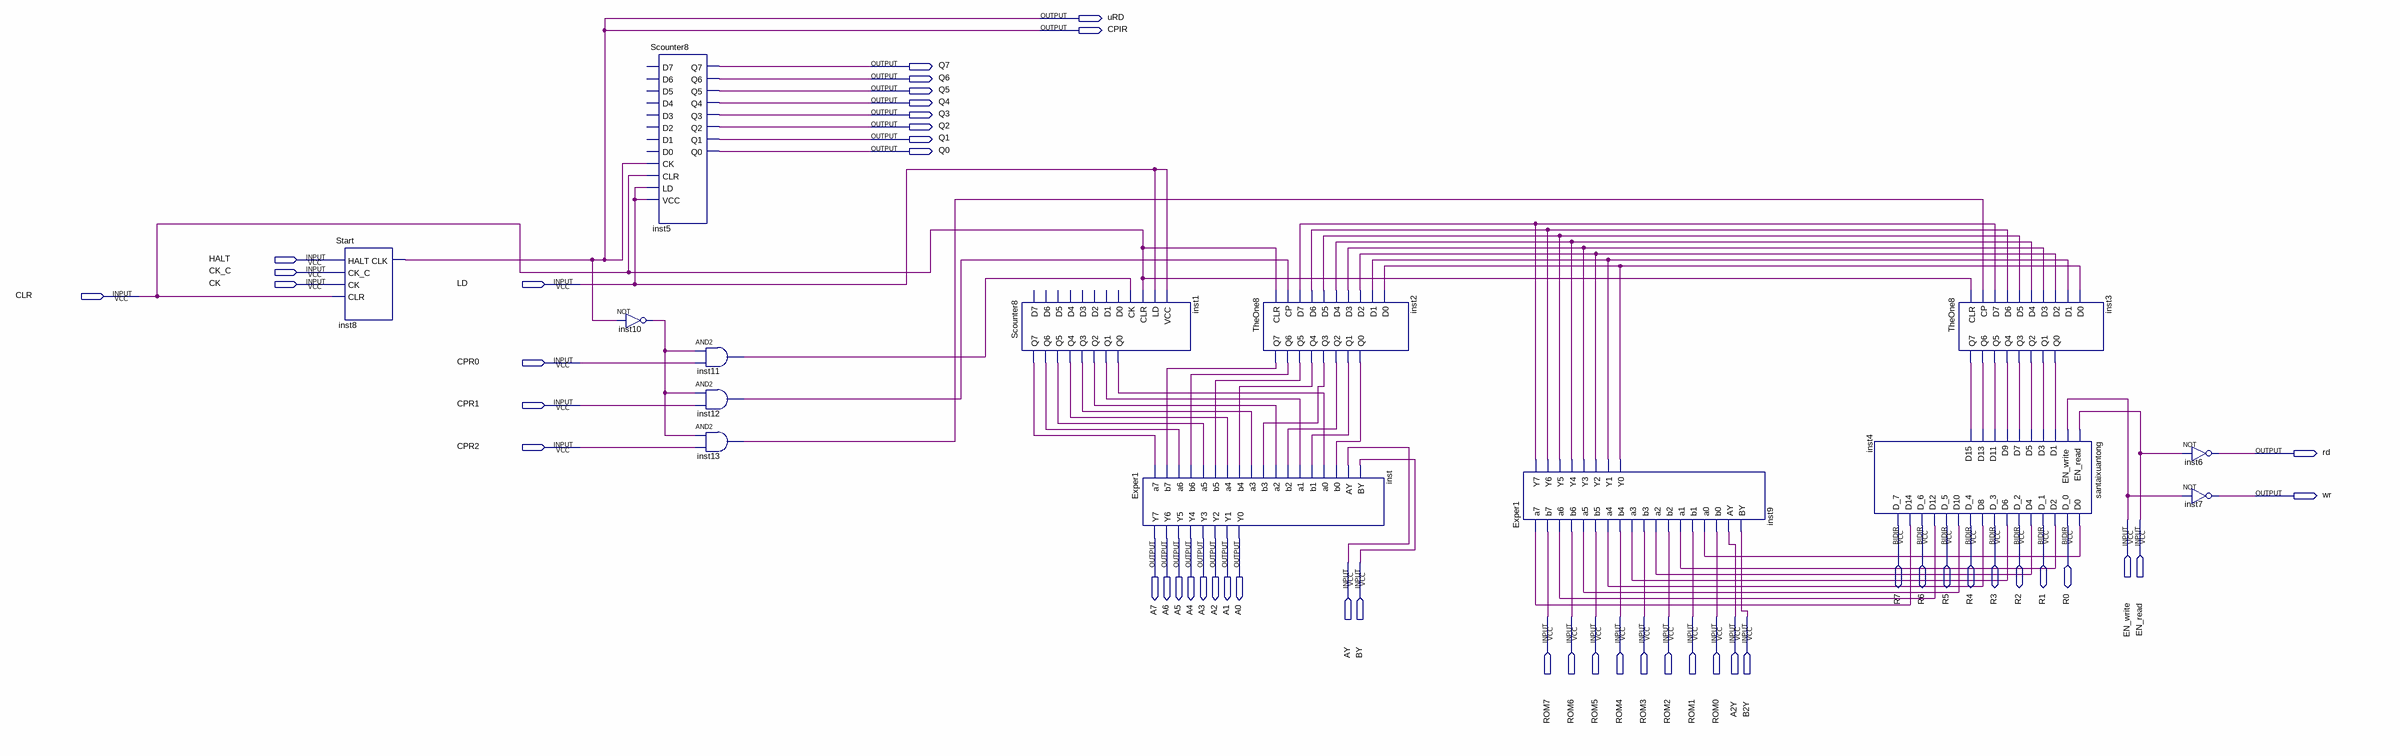
[diagram p0: schematic sheet]
// Quartus schematic Fangcun.bdf as structural Verilog: 14 symbols, 50 pins
module Fangcun (
  input  HALT,
  input  CK_C,
  input  CK,
  input  LD,
  input  CLR,
  input  CPR0,
  input  CPR1,
  input  CPR2,
  input  EN_write,
  input  EN_read,
  input  AY,
  input  BY,
  input  ROM7,
  input  ROM6,
  input  ROM5,
  input  ROM4,
  input  ROM3,
  input  ROM2,
  input  ROM1,
  input  ROM0,
  input  A2Y,
  input  B2Y,
  inout  R7,
  inout  R6,
  inout  R5,
  inout  R4,
  inout  R3,
  inout  R2,
  inout  R1,
  inout  R0,
  output uRD,
  output CPIR,
  output Q7,
  output Q6,
  output Q5,
  output Q4,
  output Q3,
  output Q2,
  output Q1,
  output Q0,
  output rd,
  output wr,
  output A7,
  output A6,
  output A5,
  output A4,
  output A3,
  output A2,
  output A1,
  output A0
);

  wire inst1_q0, inst1_q1, inst1_q2, inst1_q3, inst1_q4, inst1_q5, inst1_q6, inst1_q7, inst2_q0, inst2_q1,
       inst2_q2, inst2_q3, inst2_q4, inst2_q5, inst2_q6, inst2_q7, inst3_q0, inst3_q1, inst3_q2, inst3_q3,
       inst3_q4, inst3_q5, inst3_q6, inst3_q7, inst4_d0, inst4_d2, inst4_d4, inst4_d6, inst4_d8, inst4_d10,
       inst4_d12, inst4_d14, inst9_y0, inst9_y1, inst9_y2, inst9_y3, inst9_y4, inst9_y5, inst9_y6, inst9_y7,
       inst10_out, inst11_out, inst12_out, inst13_out;

  Start inst8 (.HALT(HALT), .CK_C(CK_C), .CK(CK), .CLR(CLR), .CLK(CPIR));
  not inst10 (inst10_out, CPIR);
  Scounter8 inst5 (
    .CK(CPIR), .CLR(CLR), .LD(LD), .VCC(LD), .Q7(Q7), .Q6(Q6), .Q5(Q5), .Q4(Q4), .Q3(Q3), .Q2(Q2), .Q1(Q1),
    .Q0(Q0));  // open: D7, D6, D5, D4, D3, D2, D1, D0
  and inst11 (inst11_out, inst10_out, CPR0);
  and inst12 (inst12_out, inst10_out, CPR1);
  and inst13 (inst13_out, inst10_out, CPR2);
  Scounter8 inst1 (
    .CK(inst11_out), .CLR(CLR), .LD(LD), .VCC(LD), .Q7(inst1_q7), .Q6(inst1_q6), .Q5(inst1_q5),
    .Q4(inst1_q4), .Q3(inst1_q3), .Q2(inst1_q2), .Q1(inst1_q1), .Q0(inst1_q0));  // open: D7, D6, D5, D4, D3, D2, D1, D0
  Exper1 inst (
    .a7(inst1_q7), .b7(inst2_q7), .a6(inst1_q6), .b6(inst2_q6), .a5(inst1_q5), .b5(inst2_q5), .a4(inst1_q4),
    .b4(inst2_q4), .a3(inst1_q3), .b3(inst2_q3), .a2(inst1_q2), .b2(inst2_q2), .a1(inst1_q1), .b1(inst2_q1),
    .a0(inst1_q0), .b0(inst2_q0), .AY(AY), .BY(BY), .Y7(A7), .Y6(A6), .Y5(A5), .Y4(A4), .Y3(A3), .Y2(A2),
    .Y1(A1), .Y0(A0));
  TheOne8 inst2 (
    .CLR(CLR), .CP(inst12_out), .D7(inst9_y7), .D6(inst9_y6), .D5(inst9_y5), .D4(inst9_y4), .D3(inst9_y3),
    .D2(inst9_y2), .D1(inst9_y1), .D0(inst9_y0), .Q7(inst2_q7), .Q6(inst2_q6), .Q5(inst2_q5), .Q4(inst2_q4),
    .Q3(inst2_q3), .Q2(inst2_q2), .Q1(inst2_q1), .Q0(inst2_q0));
  Exper1 inst9 (
    .a7(inst4_d14), .b7(ROM7), .a6(inst4_d12), .b6(ROM6), .a5(inst4_d10), .b5(ROM5), .a4(inst4_d8),
    .b4(ROM4), .a3(inst4_d6), .b3(ROM3), .a2(inst4_d4), .b2(ROM2), .a1(inst4_d2), .b1(ROM1), .a0(inst4_d0),
    .b0(ROM0), .AY(A2Y), .BY(B2Y), .Y7(inst9_y7), .Y6(inst9_y6), .Y5(inst9_y5), .Y4(inst9_y4), .Y3(inst9_y3),
    .Y2(inst9_y2), .Y1(inst9_y1), .Y0(inst9_y0));
  santaixuantong inst4 (
    .EN_read(EN_read), .EN_write(EN_write), .D1(inst3_q0), .D3(inst3_q1), .D5(inst3_q2), .D7(inst3_q3),
    .D9(inst3_q4), .D11(inst3_q5), .D13(inst3_q6), .D15(inst3_q7), .D0(inst4_d0), .D2(inst4_d2),
    .D4(inst4_d4), .D6(inst4_d6), .D8(inst4_d8), .D10(inst4_d10), .D12(inst4_d12), .D14(inst4_d14), .D_0(R0),
    .D_1(R1), .D_2(R2), .D_3(R3), .D_4(R4), .D_5(R5), .D_6(R6), .D_7(R7));
  TheOne8 inst3 (
    .CLR(CLR), .CP(inst13_out), .D7(inst9_y7), .D6(inst9_y6), .D5(inst9_y5), .D4(inst9_y4), .D3(inst9_y3),
    .D2(inst9_y2), .D1(inst9_y1), .D0(inst9_y0), .Q7(inst3_q7), .Q6(inst3_q6), .Q5(inst3_q5), .Q4(inst3_q4),
    .Q3(inst3_q3), .Q2(inst3_q2), .Q1(inst3_q1), .Q0(inst3_q0));
  not inst6 (rd, EN_read);
  not inst7 (wr, EN_write);

  assign uRD = CPIR;
endmodule
